# EAGLE design mdbt42q_breakout (EAGLE 7.7.0)
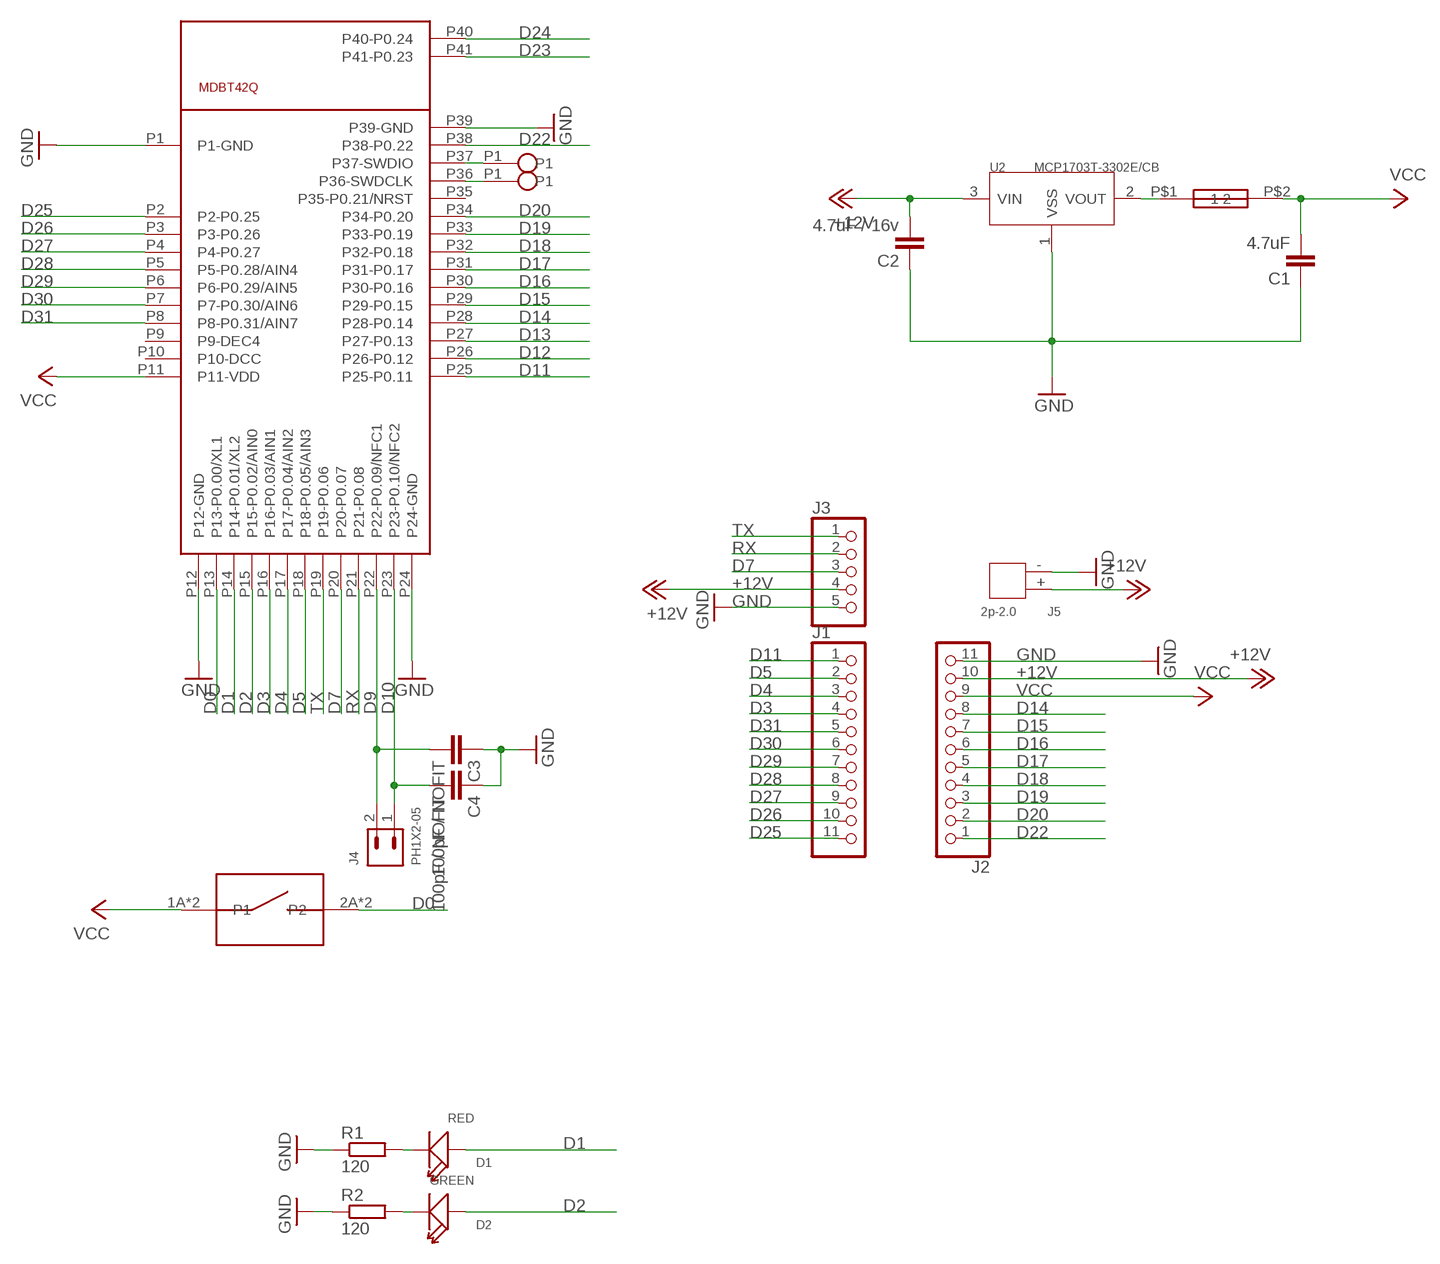
[diagram p0: schematic, sheet 1]

## Parts
BTN  KMR421NG  [KMR421NG]
C1  4.7uF  C-EUC0805  [C0805]
C2  4.7uF / 16v  C-EUC0805  [C0805]
C3  100pF / NOFIT  C-EUC0603  [C0603]
C4  100pF / NOFIT  C-EUC0603  [C0603]
D1  RED  SMD-LED-CLEAR-BLUE(0603)  [LED-0603]
D2  GREEN  SMD-LED-CLEAR-BLUE(0603)  [LED-0603]
J1  PINHD-1X11_2.54-SX  [1X11-SX]
J2  PINHD-1X11_2.54-SX  [1X11-SX]
J3  PINHD-1X05_2.54-SX  [1X05-SX]
J4  PH1X2-05  [PH005-1-2]
J5  2p-2.0  DIP-JST-2P-2.0NOSILK  [H2-2.0-6X4.5MM-NOSILK]
R1  120  R-EU_R0603  [R0603]
R2  120  R-EU_R0603  [R0603]
U1  MDBT42Q  [MDBT40]
U2  MCP1703T-3302E/CB  XC6206  [SOT23]
U$2  SINGLE  [SINGLE]
U$3  SINGLE  [SINGLE]
U$4  WIRELINK  [WIRELINK]

## Nets
+12V: C2.2 J2.10 J3.4 J5.+ U2.3(VIN)
D0: BTN.2A(P2) BTN.2B(P2) U1.P13(P13-P0.00/XL1)
D1: D1.+ U1.P14(P14-P0.01/XL2)
D2: D2.+ U1.P15(P15-P0.02/AIN0)
D3: J1.4 U1.P16(P16-P0.03/AIN1)
D4: J1.3 U1.P17(P17-P0.04/AIN2)
D5: J1.2 U1.P18(P18-P0.05/AIN3)
D7: J3.3 U1.P20(P20-P0.07)
D9: C3.2 J4.2 U1.P22(P22-P0.09/NFC1)
D10: C4.2 J4.1 U1.P23(P23-P0.10/NFC2)
D11: J1.1 U1.P25(P25-P0.11)
D12: U1.P26(P26-P0.12)
D13: U1.P27(P27-P0.13)
D14: J2.8 U1.P28(P28-P0.14)
D15: J2.7 U1.P29(P29-P0.15)
D16: J2.6 U1.P30(P30-P0.16)
D17: J2.5 U1.P31(P31-P0.17)
D18: J2.4 U1.P32(P32-P0.18)
D19: J2.3 U1.P33(P33-P0.19)
D20: J2.2 U1.P34(P34-P0.20)
D22: J2.1 U1.P38(P38-P0.22)
D23: U1.P41(P41-P0.23)
D24: U1.P40(P40-P0.24)
D25: J1.11 U1.P2(P2-P0.25)
D26: J1.10 U1.P3(P3-P0.26)
D27: J1.9 U1.P4(P4-P0.27)
D28: J1.8 U1.P5(P5-P0.28/AIN4)
D29: J1.7 U1.P6(P6-P0.29/AIN5)
D30: J1.6 U1.P7(P7-P0.30/AIN6)
D31: J1.5 U1.P8(P8-P0.31/AIN7)
GND: C1.1 C2.1 C3.1 C4.1 J2.11 J3.5 J5.- R1.1 R2.1 U1.P1(P1-GND) U1.P12(P12-GND) U1.P24(P24-GND) U1.P39(P39-GND) U2.1(VSS)
N$1: U1.P37(P37-SWDIO) U$2.P1
N$2: U1.P36(P36-SWDCLK) U$3.P1
N$3: U2.2(VOUT) U$4.P$1
N$5: D1.- R1.2
N$7: D2.- R2.2
RX: J3.2 U1.P21(P21-P0.08)
TX: J3.1 U1.P19(P19-P0.06)
VCC: BTN.1A(P1) BTN.1B(P1) C1.2 J2.9 U1.P11(P11-VDD) U$4.P$2
Unconnected: U1.P9(P9-DEC4) U1.P10(P10-DCC) U1.P35(P35-P0.21/NRST)

## Library data of the parts
BTN = KMR421NG:KMR421NG
C1-C4 = rcl:C-EU: CAPACITOR, European symbol
D1 D2 = Seeed-OPL-Diode:SMD-LED-CLEAR-BLUE(0603): 304090045; MPN: 19-217-BHC-ZL1M2RY-3T; VALUE: BLUE-0603
J1 J2 = pinhead-2:PINHD-1X11: PIN HEADER
J3 = pinhead-2:PINHD-1X05: PIN HEADER
J4 = pel_hdr:PH1X2
J5 = Seeed-OPL-Connector:DIP-JST-2P-2.0: 320110049
R1 R2 = rcl:R-EU_: RESISTOR, European symbol
U1 = mdbt42:MDBT42Q
U2 = xc6206:XC6206
U$2 U$3 = testpoint:SINGLE
U$4 = solder_jumper:WIRELINK

## Board
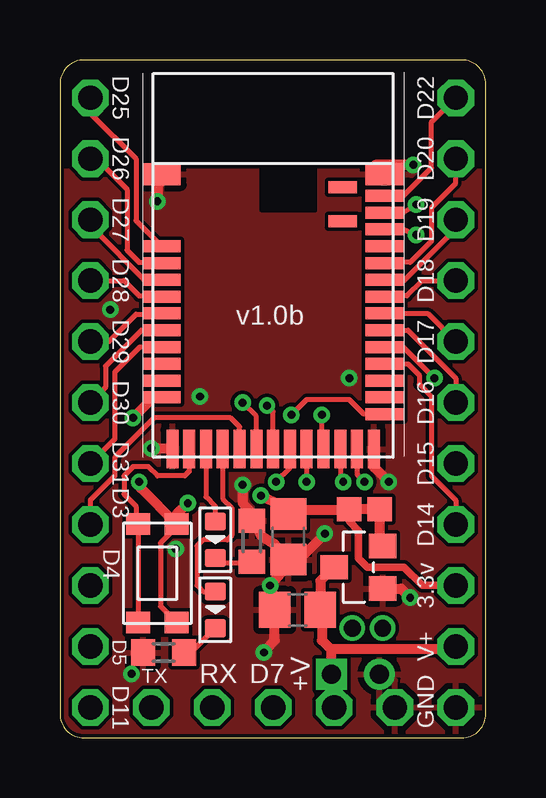
[diagram p1: board, top side]
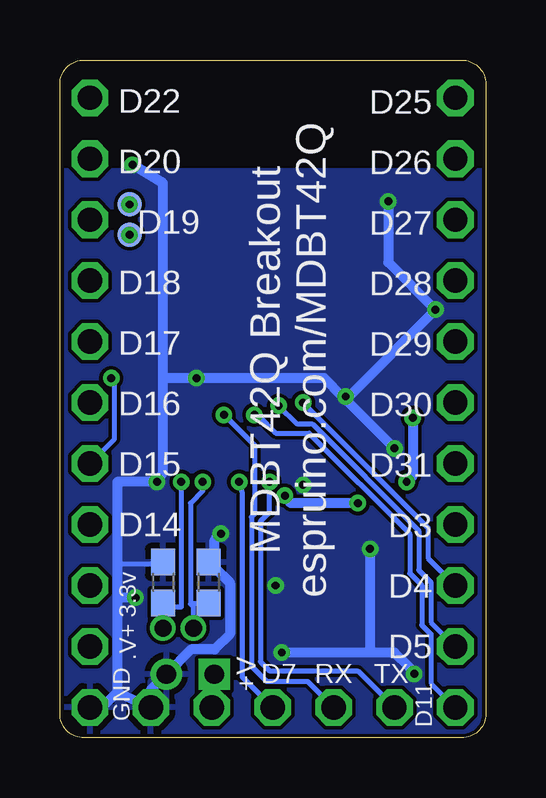
[diagram p2: board, bottom side, seen from below]

Size 17.76 x 28.25 mm. Coordinates in mm from the lower left corner, seen from the top.
Outline: 16.76,28.25 1,28.25 arc90 0,27.25 0,1 arc90 1,0 16.76,0 arc90 17.76,1 17.76,27.25 arc90 16.76,28.25
Copper layers (1*16): Top 0.035559375mm / dielectric 0.17018125mm / Bottom 0.035559375mm
Design rules "pimoroni_espruino": minimum track width 8mil, minimum drill 10mil, track to track 6mil, track to pad 6mil, pad to pad 6mil, via to via 6mil, smd to smd 0mil, copper to edge 6mil, drill to drill 6mil, minimum pad ring 7mil, minimum via ring 7mil, stop-mask expansion 6mil, vias tented up to drill 15mil, thermal gap 10mil

### Footprints (pad centres in the part's own frame; a part is rotated, then mirrored left to right if it is on the bottom)
KMR421NG = smd 0.9 x 1: 1A -2.05,0.8; 1B 2.05,0.8; 2A -2.05,-0.8; 2B 2.05,-0.8
C0805 = smd 1.3 x 1.5: 1 -0.95,0; 2 0.95,0
C0603 = smd 1.1 x 1: 1 -0.85,0; 2 0.85,0
LED-0603 = smd 0.762 x 0.889: + -0.762,0; - 0.762,0
1X11-SX = drill 1.016 octagon: 1 -12.7,0; 2 -10.16,0; 3 -7.62,0; 4 -5.08,0; 5 -2.54,0; 6 0,0; 7 2.54,0; 8 5.08,0; 9 7.62,0; 10 10.16,0; 11 12.7,0
1X05-SX = drill 1.016 octagon: 1 -5.08,0; 2 -2.54,0; 3 0,0; 4 2.54,0; 5 5.08,0
PH005-1-2 = drill 0.7 pad 1.016: 1 0,0; 2 1.27,0
H2-2.0-6X4.5MM-NOSILK = drill 0.8 pad 1.3 square: + -1,0.75 | drill 0.8 pad 1.3: - 1,0.75
R0603 = smd 1 x 1.1: 1 -0.85,0; 2 0.85,0
MDBT40 = smd 1.6 x 0.9: P1 -4.65,3.8; P39 4.65,3.8 | smd 1.6 x 0.5: P2 -4.65,0.8; P3 -4.65,0.1; P4 -4.65,-0.6; P5 -4.65,-1.3; P6 -4.65,-2; P7 -4.65,-2.7; P8 -4.65,-3.4; P9 -4.65,-4.1; P10 -4.65,-4.8; P11 -4.65,-5.5; P25 4.65,-6.2; P26 4.65,-5.5; P27 4.65,-4.8; P28 4.65,-4.1; P29 4.65,-3.4; P30 4.65,-2.7; P31 4.65,-2; P32 4.65,-1.3; P33 4.65,-0.6; P34 4.65,0.1; P35 4.65,0.8; P36 4.65,1.5; P37 4.65,2.2; P38 4.65,2.9 | smd 0.5 x 1.6: P12 -4.2,-7.65; P13 -3.5,-7.65; P14 -2.8,-7.65; P15 -2.1,-7.65; P16 -1.4,-7.65; P17 -0.7,-7.65; P18 0,-7.65; P19 0.7,-7.65; P20 1.4,-7.65; P21 2.1,-7.65; P22 2.8,-7.65; P23 3.5,-7.65; P24 4.2,-7.65 | smd 1.2 x 0.5: P40 2.9,3.25; P41 2.9,1.85
SOT23 = smd 1.016 x 1.143: 1 -0.889,-1.016; 2 0.889,-1.016; 3 0,1.016
SINGLE = smd 1.016 x 1.016: P1 0,0
WIRELINK = smd 1.016 x 1.016: P$1 -0.635,0; P$2 0.635,0

### Placement (x,y rotation side)
BTN  4.06,6.86 270 top
C1  9.53,8.38 90 top
C2  9.91,5.33 0 top
C3  11.56,6.48 270 bottom
C4  13.46,6.48 270 bottom
D1  6.48,8.26 270 top
D2  6.48,5.33 270 top
J1  1.27,13.97 90 top
J2  16.51,13.97 270 top
J3  8.89,1.27 0 top
J4  13.46,4.57 180 top
J5  12.32,1.91 0 top
R1  8,8.19 270 top
R2  4.32,3.56 0 top
U1  8.89,19.68 0 top
U2  12.45,7.11 90 top
U$2  14.86,22.23 90 bottom
U$3  14.86,20.95 0 bottom
U$4  12.7,9.53 180 top

### Tracks (layer width: path | path; a pad name or v marks a point on that pad's centre or on a via)
+12V
  Top 0.406: C2.2 10.63,5.29 | C2.2 10.86,5.14 | U2.3 10.86,6.54 C2.2 | 10.86,5.14 10.92,5.08 | 10.86,5.14 10.92,5.14 10.92,4.06 11.3,3.68 | J2.10 16,3.81 15.88,3.68 11.3,3.68 | 11.3,3.68 11.3,2.67 J5.+
  Bottom 0.406: J5.+ 11.32,1.38 J3.4
D0
  Top 0.203: U1.P13 5.39,11.11 5.21,10.92 4.06,10.92 3.68,11.3 3.05,11.3 2.67,10.92 2.67,10.16 3.17,9.65 3.17,9 BTN.2A BTN.2B
D1
  Top 0.203: U1.P14 6.09,10.04 6.48,9.65 D1.+
D2
  Top 0.203: U1.P15 6.79,9.97 7.18,9.59 7.18,8.45 6.99,8.26 5.97,8.26 5.71,8 5.71,6.35 5.97,6.1 D2.+ 6.6,6.22
D3
  Top 0.203: U1.P16 7.49,12.96 7.11,13.34 3.94,13.34 2.29,11.68 2.29,10.92 1.27,9.91 J1.4
D4  (via drill 0.33)
  Top 0.203: U1.P17 8.19,13.4 v7.62,13.97
  Bottom 0.203: v7.62,13.97 2.41,8.76 2.41,7.49 J1.3
D5  (via drill 0.33)
  Top 0.203: U1.P18 8.89,13.59 v8.64,13.84
  Bottom 0.203: v8.64,13.84 7.87,13.08 7.24,13.08 2.79,8.64 2.79,6.99 2.29,6.48 2.29,4.83 J1.2
D7  (via drill 0.33)
  Top 0.203: U1.P20 10.29,10.93 v10.29,10.67
  Bottom 0.203: v10.29,10.67 10.16,10.22 10.16,2.54 J3.3
D9  (via drill 0.33)
  Top 0.203: U1.P22 11.69,10.79 v11.81,10.67
  Bottom 0.203: v11.81,10.67 11.81,10.29 12.32,9.78 12.32,5.59 | C3.2 11.6,5.59 12.32,5.59 | J4.2 12.19,5.46 12.32,5.59
D10  (via drill 0.33)
  Top 0.203: U1.P23 12.39,10.98 v12.7,10.67
  Bottom 0.203: v12.7,10.67 12.7,5.46 13.3,5.46 C4.2 J4.1
D11  (via drill 0.33)
  Top 0.203: U1.P25 12.68,13.48 12.06,14.1 10.29,14.1 v9.65,13.46
  Bottom 0.203: v9.65,13.46 9.53,13.46 8.76,12.7 7.37,12.7 3.17,8.51 3.17,6.86 2.67,6.35 2.67,4.7 2.29,4.32 2.29,2.29 J1.1
D14
  Top 0.203: U1.P28 14.51,15.59 14.99,15.11 14.99,14.73 15.49,14.22 15.49,10.92 16.51,9.91 J2.8
D15  (via drill 0.33)
  Top 0.203: U1.P29 14.32,16.29 v15.62,14.99
  Bottom 0.203: v15.62,14.99 15.49,14.73 15.49,12.45 J2.7
D16
  Top 0.203: U1.P30 14.51,16.98 16.51,14.99 J2.6
D17
  Top 0.203: U1.P31 15.34,17.68 J2.5
D18
  Top 0.203: U1.P32 13.57,18.41 14.48,18.41 15.11,19.05 J2.4
D19
  Top 0.203: U1.P33 13.57,19.05 14.35,19.05 16.51,21.21 J2.3
D20
  Top 0.203: U1.P34 13.57,19.81 14.61,19.81 15.49,20.7 15.49,22.1 16.51,23.11 J2.2
D22
  Top 0.203: U1.P38 14.33,22.59 15.49,23.75 15.49,25.65 J2.1
D25
  Top 0.203: J1.11 1.27,26.04 3.17,24.13 3.17,21.55 U1.P2
D26
  Top 0.203: J1.10 1.52,24.13 2.79,22.86 2.79,20.32 3.3,19.81 4.21,19.81 U1.P3
D27
  Top 0.203: J1.9 1.4,21.46 1.4,21.21 3.56,19.05 4.21,19.05 U1.P4
D28
  Top 0.203: J1.8 2.67,19.05 3.3,18.41 4.21,18.41 U1.P5
D29
  Top 0.203: J1.7 2.03,16.51 3.17,17.65 4.21,17.65 U1.P6
D30
  Top 0.203: U1.P7 3.4,16.98 1.91,15.49 1.91,14.61 J1.6
D31
  Top 0.203: U1.P8 3.33,16.29 2.29,15.24 2.29,12.45 J1.5
GND  (via drill 0.33)
  Top 0.406: U1.P24 13.09,11.29 v13.72,10.67 | U1.P1 4.24,23.19 4.06,23.19 v4.06,22.35 | 13.97,23.62 14.22,23.88 v14.73,23.88 13.15,23.88 U1.P39 | 9.53,7.24 C1.1 9.02,7.91 arc45 8.91,8.1 8.42,8.4 arc-45 8.33,8.61 8.12,8.87 arc45 8.06,8.9 arc-45 R1.1 7.87,9.11 7.87,9.53 7.62,9.78 v7.62,10.54 | 9.53,7.24 v8.76,6.35 8.87,6.38 8.87,5.52 C2.1 8.96,4.06 v8.51,3.56 | U2.1 14.22,6.22 v14.61,5.84 | v3.81,12.06 4.66,12.06 U1.P12 | 9.53,7.24 9.78,7.24 v11.05,8.51
  Bottom 0.203: C4.1 13.55,7.24 15.37,7.24
  Bottom 0.406: 15.37,5.71 15.37,7.24 15.37,10.67 v13.72,10.67 13.46,11.05 13.46,14.86 | 15.37,5.71 15.37,1.91 | 15.37,1.91 J3.5 13.97,2 J5.- 12.29,3.68 11.3,3.68 10.67,4.32 10.67,6.44 | 13.46,14.86 13.46,23.11 v14.73,23.88 | C3.1 10.67,6.44 | 8.8,6.29 8.76,6.38 | v4.06,22.35 4.06,19.81 v2.1,17.84 5.71,14.22 v5.84,14.22 | J2.11 16,1.27 15.37,1.91 | v14.61,5.84 15.24,5.84 15.37,5.71 | 13.46,14.86 13.34,14.99 v12.06,14.99 6.73,14.99 5.97,14.22 v5.84,14.22 | v5.84,14.22 5.84,14.1 v3.81,12.06 | v2.98,2.67 3.17,2.92 3.81,3.56 4.7,3.56 | 4.7,3.56 v8.51,3.56 | v4.83,7.87 4.83,3.68 4.7,3.56 | 10.67,6.44 10.67,6.48 11.3,7.11 11.3,8.26 v11.05,8.51
  pour Bottom: 0,23.62 17.78,23.62 17.78,0 0,0
  pour Top: 0,23.62 17.78,23.62 17.78,0 0,0
N$1  (via drill 0.33)
  Top 0.203: U1.P37 14.31,21.89 U$2.P1
  other vias: 14.86,22.23
N$2  (via drill 0.33)
  Top 0.203: U1.P36 14.33,21.18 U$3.P1
  Bottom 0.203: 14.86,21.21 U$3.P1
  other vias: 14.86,20.95
N$3
  Top 0.406: U2.2 13.34,8.13 U$4.P$1
N$5
  Top 0.203: 6.54,7.43 D1.- 6.67,7.3 7.98,7.3 R1.2
N$7
  Top 0.203: R2.2 5.59,3.68 D2.-
RX  (via drill 0.33)
  Top 0.203: U1.P21 10.92,12.1 v10.92,13.46
  Bottom 0.203: v10.92,13.46 9.65,12.19 9.65,9.34 9.78,9.21 9.78,2.98 9.14,2.35 7.43,2.35 J3.2
TX  (via drill 0.33)
  Top 0.203: U1.P19 9.59,11.24 v9.02,10.67
  Bottom 0.203: J3.1 5.33,2.79 9.02,2.79 9.4,3.17 9.4,9.02 9.02,9.4 v9.02,10.67
VCC  (via drill 0.33)
  Top 0.203: 12.06,9.02 U$4.P$2 | 4.83,8.87 4.83,8.76 4.19,8.13 4.19,5.48 BTN.1B
  Top 0.305: J2.9 15.11,6.35 14.35,7.11 12.83,7.11 12.45,7.49 12.45,8.64 12.06,9.02
  Top 0.406: U1.P11 3.86,14.15 v3.05,13.34 | 4.83,8.87 BTN.1A | BTN.1B 4.83,4.85 | 9.4,9.53 9.4,9.23 C1.2 | C1.2 9.68,9.49 11.97,9.49 arc45 U$4.P$2 | v3.3,10.67 3.36,10.41 BTN.1A | BTN.1A 4.86,9.31 v5.33,9.78 | v8.38,10.1 8.51,10.03 9.08,9.78 C1.2
  Bottom 0.406: v3.05,13.34 3.05,10.92 v3.3,10.67 | v5.33,9.78 8.13,9.78 v8.38,10.1

### Text on the board
tNames: D25 | D22 | D26 | D20 | D27 | D19 | D28 | D18 | D29 | v1.0b | D17 | D30 | D16 | D31 | D15 | D3 | D14 | D4 | 3.3v | D5 | V+ | +V | TX | RX | D7 | GND | D11
bNames: MDBT42Q Breakout / espruino.com/MDBT42Q | D22 / D20 / D19 / D18 / D17 / D16 / D15 / D14 | D25 / D26 / D27 / D28 / D29 / D30 / D31 / D3 / D4 / D5 | +V | .V+ 3.3v | TX | RX | D7 | D11 | GND